# EAGLE design aria-BOB (EAGLE 7.2.0)
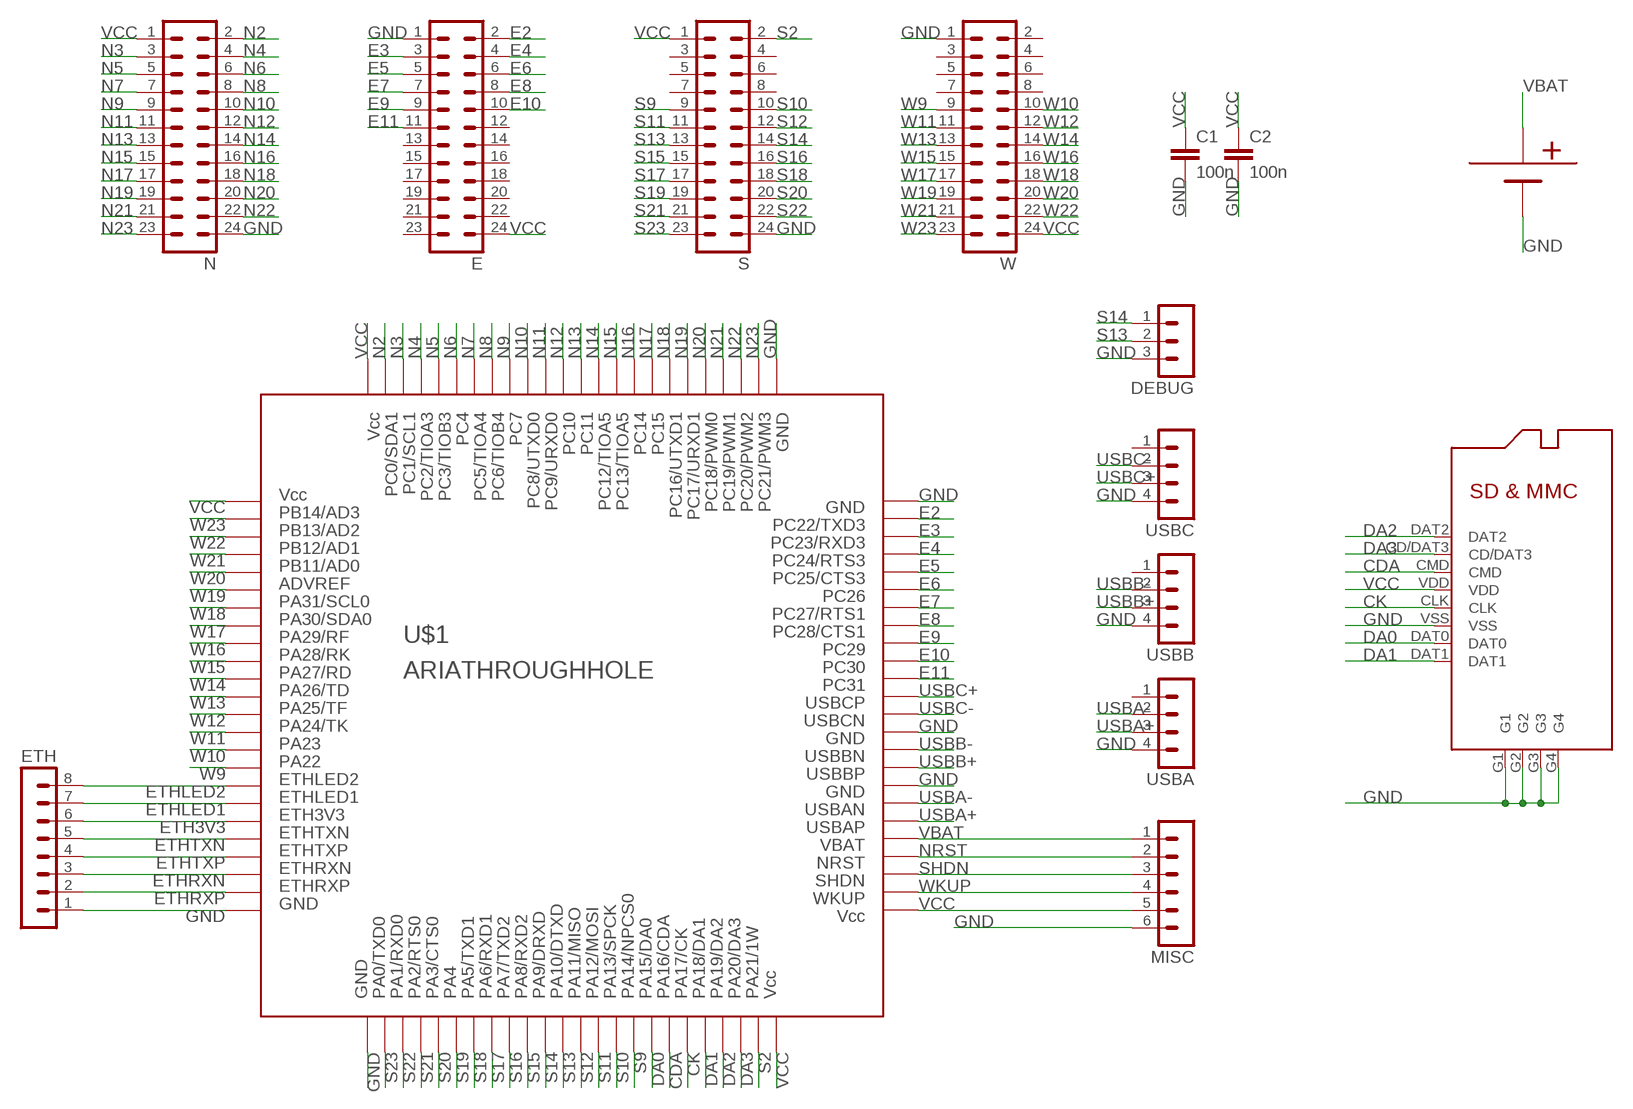
[diagram p0: schematic, sheet 1]

## Parts
C1  100n  C-EUC0603  [C0603]
C2  100n  C-EUC0603  [C0603]
DEBUG  MA03-1  [MA03-1]
E  MA12-2  [MA12-2]
ETH  MA08-1  [MA08-1]
MISC  MA06-1  [MA06-1]
N  MA12-2  [MA12-2]
S  MA12-2  [MA12-2]
U$1  ARIATHROUGHHOLE  [ARIA-TROUGHHOLE]
U$3  BAT  [BAT-CR1220]
U$4  MICRO-SD  [MISCRO-SD]
USBA  MA04-1  [MA04-1]
USBB  MA04-1  [MA04-1]
USBC  MA04-1  [MA04-1]
W  MA12-2  [MA12-2]

## Nets
CDA: U$1.S7 U$4.CMD
CK: U$1.S6 U$4.CLK
DA0: U$1.S8 U$4.DAT0
DA1: U$1.S5 U$4.DAT1
DA2: U$1.S4 U$4.DAT2
DA3: U$1.S3 U$4.CD/DAT3
E2: E.2 U$1.E2
E3: E.3 U$1.E3
E4: E.4 U$1.E4
E5: E.5 U$1.E5
E6: E.6 U$1.E6
E7: E.7 U$1.E7
E8: E.8 U$1.E8
E9: E.9 U$1.E9
E10: E.10 U$1.E10
E11: E.11 U$1.E11
ETH3V3: ETH.6 U$1.W6
ETHLED1: ETH.7 U$1.W7
ETHLED2: ETH.8 U$1.W8
ETHRXN: ETH.3 U$1.W3
ETHRXP: ETH.2 U$1.W2
ETHTXN: ETH.5 U$1.W5
ETHTXP: ETH.4 U$1.W4
GND: C1.2 C2.2 DEBUG.3 E.1 ETH.1 MISC.6 N.24 S.24 U$1.E1 U$1.E14 U$1.E17 U$1.N24 U$1.S24 U$1.W1 U$3.BAT- U$4.G1 U$4.G2 U$4.G3 U$4.G4 U$4.VSS USBA.4 USBB.4 USBC.4 W.1
N2: N.2 U$1.N2
N3: N.3 U$1.N3
N4: N.4 U$1.N4
N5: N.5 U$1.N5
N6: N.6 U$1.N6
N7: N.7 U$1.N7
N8: N.8 U$1.N8
N9: N.9 U$1.N9
N10: N.10 U$1.N10
N11: N.11 U$1.N11
N12: N.12 U$1.N12
N13: N.13 U$1.N13
N14: N.14 U$1.N14
N15: N.15 U$1.N15
N16: N.16 U$1.N16
N17: N.17 U$1.N17
N18: N.18 U$1.N18
N19: N.19 U$1.N19
N20: N.20 U$1.N20
N21: N.21 U$1.N21
N22: N.22 U$1.N22
N23: N.23 U$1.N23
NRST: MISC.2 U$1.E21
S2: S.2 U$1.S2
S9: S.9 U$1.S9
S10: S.10 U$1.S10
S11: S.11 U$1.S11
S12: S.12 U$1.S12
S13: DEBUG.2 S.13 U$1.S13
S14: DEBUG.1 S.14 U$1.S14
S15: S.15 U$1.S15
S16: S.16 U$1.S16
S17: S.17 U$1.S17
S18: S.18 U$1.S18
S19: S.19 U$1.S19
S20: S.20 U$1.S20
S21: S.21 U$1.S21
S22: S.22 U$1.S22
S23: S.23 U$1.S23
SHDN: MISC.3 U$1.E22
USBA+: U$1.E19 USBA.3
USBA-: U$1.E18 USBA.2
USBB+: U$1.E16 USBB.3
USBB-: U$1.E15 USBB.2
USBC+: U$1.E12 USBC.3
USBC-: U$1.E13 USBC.2
VBAT: MISC.1 U$1.E20 U$3.BAT1+(BAT+) U$3.BAT+
VCC: C1.1 C2.1 E.24 MISC.5 N.1 S.1 U$1.E24 U$1.N1 U$1.S1 U$1.W24 U$4.VDD W.24
W9: U$1.W9 W.9
W10: U$1.W10 W.10
W11: U$1.W11 W.11
W12: U$1.W12 W.12
W13: U$1.W13 W.13
W14: U$1.W14 W.14
W15: U$1.W15 W.15
W16: U$1.W16 W.16
W17: U$1.W17 W.17
W18: U$1.W18 W.18
W19: U$1.W19 W.19
W20: U$1.W20 W.20
W21: U$1.W21 W.21
W22: U$1.W22 W.22
W23: U$1.W23 W.23
WKUP: MISC.4 U$1.E23
Unconnected: E.12 E.13 E.14 E.15 E.16 E.17 E.18 E.19 E.20 E.21 E.22 E.23 S.3 S.4 S.5 S.6 S.7 S.8 USBA.1 USBB.1 USBC.1 W.2 W.3 W.4 W.5 W.6 W.7 W.8

## Library data of the parts
C1 C2 = rcl:C-EU: CAPACITOR, European symbol
DEBUG = con-lstb:MA03-1: PIN HEADER; OC_FARNELL: unknown; OC_NEWARK: unknown
E N S W = con-lstb:MA12-2: PIN HEADER; OC_FARNELL: unknown; OC_NEWARK: unknown
ETH = con-lstb:MA08-1: PIN HEADER; OC_FARNELL: unknown; OC_NEWARK: unknown
MISC = con-lstb:MA06-1: PIN HEADER; OC_FARNELL: unknown; OC_NEWARK: unknown
U$1 = octanis-beat:ARIA
U$3 = octanis-beat:BAT
U$4 = octanis-beat:MICRO-SD
USBA USBB USBC = con-lstb:MA04-1: PIN HEADER; OC_FARNELL: unknown; OC_NEWARK: unknown

## Board
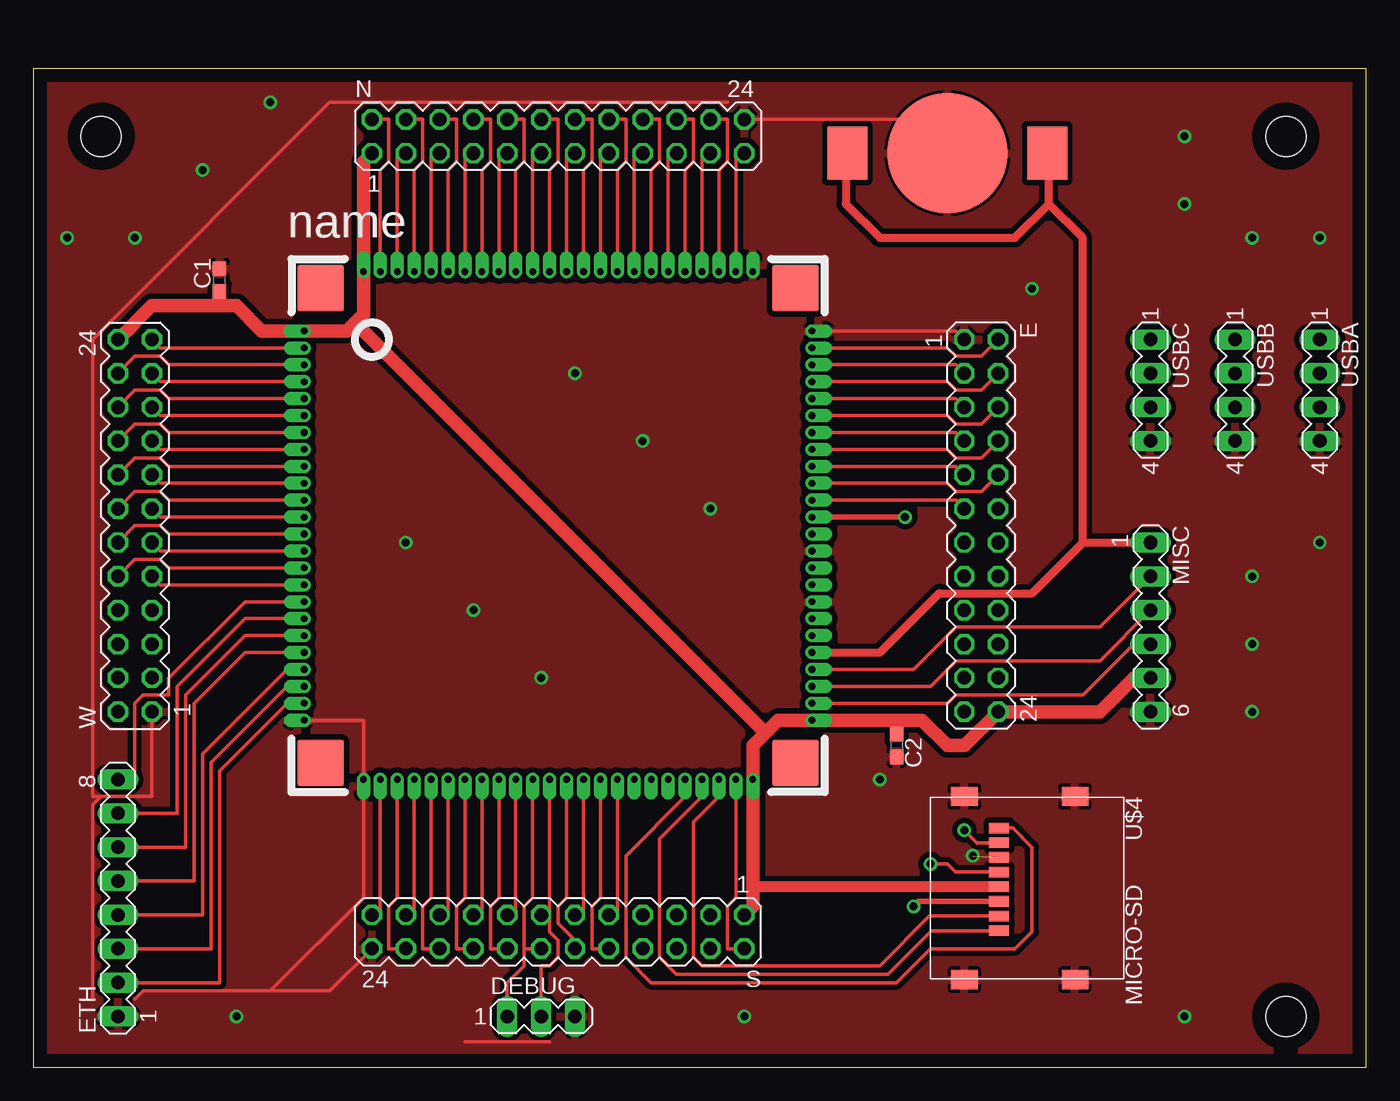
[diagram p1: board, top side]
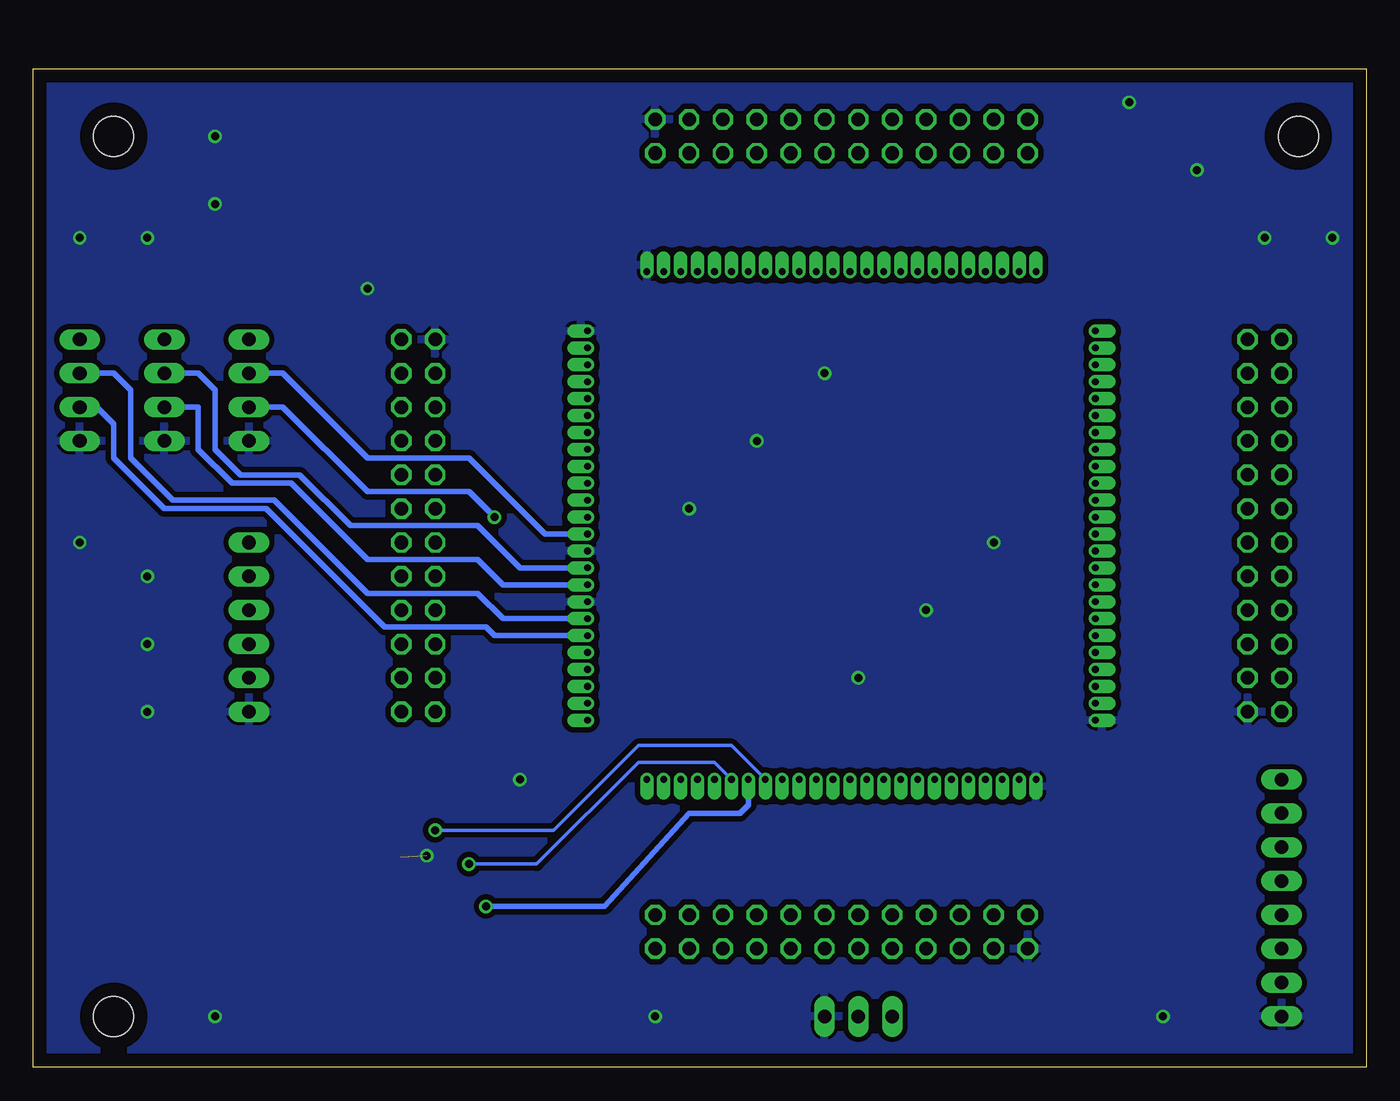
[diagram p2: board, bottom side, seen from below]

Size 100 x 74.92 mm. Coordinates in mm from the lower left corner, seen from the top.
Outline: 0,0 100,0 100,74.92 0,74.92 0,0
Copper layers (1*16): Top 0.035mm / dielectric 1.5mm / Bottom 0.035mm
Design rules "default": minimum track width 10mil, minimum drill 24mil, track to track 8mil, track to pad 8mil, pad to pad 8mil, via to via 8mil, smd to smd 8mil, copper to edge 40mil, drill to drill 8mil, minimum pad ring 10mil, minimum via ring 8mil, stop-mask expansion 4mil, vias tented up to drill 0mil, thermal gap 10mil
Holes 3 mm at 5.08,69.85 93.98,69.85 93.98,3.81

### Footprints (pad centres in the part's own frame; a part is rotated, then mirrored left to right if it is on the bottom)
C0603 = smd 1.1 x 1: 1 -0.85,0; 2 0.85,0
MA03-1 = drill 1.016 long: 1 -2.54,0; 2 0,0; 3 2.54,0
MA12-2 = drill 1.016 octagon: 1 -13.97,-1.27; 2 -13.97,1.27; 3 -11.43,-1.27; 4 -11.43,1.27; 5 -8.89,-1.27; 6 -8.89,1.27; 7 -6.35,-1.27; 8 -6.35,1.27; 9 -3.81,-1.27; 10 -3.81,1.27; 11 -1.27,-1.27; 12 -1.27,1.27; 13 1.27,-1.27; 14 1.27,1.27; 15 3.81,-1.27; 16 3.81,1.27; 17 6.35,-1.27; 18 6.35,1.27; 19 8.89,-1.27; 20 8.89,1.27; 21 11.43,-1.27; 22 11.43,1.27; 23 13.97,-1.27; 24 13.97,1.27
MA08-1 = drill 1.016 long: 1 -8.89,0; 2 -6.35,0; 3 -3.81,0; 4 -1.27,0; 5 1.27,0; 6 3.81,0; 7 6.35,0; 8 8.89,0
MA06-1 = drill 1.016 long: 1 -6.35,0; 2 -3.81,0; 3 -1.27,0; 4 1.27,0; 5 3.81,0; 6 6.35,0
ARIA-TROUGHHOLE = drill 0.5 pad 0.813 offset: E1 19.05,14.605; E2 19.05,13.335; E3 19.05,12.065; E4 19.05,10.795; E5 19.05,9.525; E6 19.05,8.255; E7 19.05,6.985; E8 19.05,5.715; E9 19.05,4.445; E10 19.05,3.175; E11 19.05,1.905; E12 19.05,0.635; E13 19.05,-0.635; E14 19.05,-1.905; E15 19.05,-3.175; E16 19.05,-4.445; E17 19.05,-5.715; E18 19.05,-6.985; E19 19.05,-8.255; E20 19.05,-9.525; E21 19.05,-10.795; E22 19.05,-12.065; E23 19.05,-13.335; E24 19.05,-14.605; N1 -14.605,19.05; N2 -13.335,19.05; N3 -12.065,19.05; N4 -10.795,19.05; N5 -9.525,19.05; N6 -8.255,19.05; N7 -6.985,19.05; N8 -5.715,19.05; N9 -4.445,19.05; N10 -3.175,19.05; N11 -1.905,19.05; N12 -0.635,19.05; N13 0.635,19.05; N14 1.905,19.05; N15 3.175,19.05; N16 4.445,19.05; N17 5.715,19.05; N18 6.985,19.05; N19 8.255,19.05; N20 9.525,19.05; N21 10.795,19.05; N22 12.065,19.05; N23 13.335,19.05; N24 14.605,19.05; S1 14.605,-19.05; S2 13.335,-19.05; S3 12.065,-19.05; S4 10.795,-19.05; S5 9.525,-19.05; S6 8.255,-19.05; S7 6.985,-19.05; S8 5.715,-19.05; S9 4.445,-19.05; S10 3.175,-19.05; S11 1.905,-19.05; S12 0.635,-19.05; S13 -0.635,-19.05; S14 -1.905,-19.05; S15 -3.175,-19.05; S16 -4.445,-19.05; S17 -5.715,-19.05; S18 -6.985,-19.05; S19 -8.255,-19.05; S20 -9.525,-19.05; S21 -10.795,-19.05; S22 -12.065,-19.05; S23 -13.335,-19.05; S24 -14.605,-19.05; W1 -19.05,-14.605; W2 -19.05,-13.335; W3 -19.05,-12.065; W4 -19.05,-10.795; W5 -19.05,-9.525; W6 -19.05,-8.255; W7 -19.05,-6.985; W8 -19.05,-5.715; W9 -19.05,-4.445; W10 -19.05,-3.175; W11 -19.05,-1.905; W12 -19.05,-0.635; W13 -19.05,0.635; W14 -19.05,1.905; W15 -19.05,3.175; W16 -19.05,4.445; W17 -19.05,5.715; W18 -19.05,6.985; W19 -19.05,8.255; W20 -19.05,9.525; W21 -19.05,10.795; W22 -19.05,12.065; W23 -19.05,13.335; W24 -19.05,14.605 | smd 3.5 x 3.5: H1 -17.8,17.8; H2 17.8,17.8; H3 17.8,-17.8; H4 -17.8,-17.8
BAT-CR1220 = smd 3 x 4: BAT1+ 7.5,0; BAT+ -7.5,0 | smd 9 x 9: BAT- 0,0
MISCRO-SD = smd 0.8 x 1.5: CD/DAT3 8.98,2.6; CLK 5.68,2.6; CMD 7.88,2.6; DAT0 3.48,2.6; DAT1 2.38,2.6; DAT2 10.08,2.6; VDD 6.78,2.6; VSS 4.58,2.6 | smd 1.45 x 2: G1 13.75,0; G2 13.75,8.3; G3 0,8.3; G4 0,0
MA04-1 = drill 1.016 long: 1 -3.81,0; 2 -1.27,0; 3 1.27,0; 4 3.81,0

### Placement (x,y rotation side)
C1  13.97,59.05 90 top
C2  64.77,24.13 270 top
DEBUG  38.1,3.81 0 top
E  71.12,40.64 270 top
ETH  6.35,12.7 90 top
MISC  83.82,33.02 270 top
N  39.37,69.85 0 top
S  39.37,10.16 180 top
U$1  39.37,40.64 0 top
U$3  68.58,68.58 0 top
U$4  69.85,20.32 270 top
USBA  96.52,50.8 270 top
USBB  90.17,50.8 270 top
USBC  83.82,50.8 270 top
W  7.62,40.64 90 top

### Tracks (layer width: path | path; a pad name or v marks a point on that pad's centre or on a via)
CDA  (via drill 0.6)
  Top 0.406: v66.04,12.07 66.42,12.44 U$4.CMD
  Bottom 0.406: v66.04,12.07 57.15,12.07 50.8,19.05 46.99,19.05 46.35,19.68 U$1.S7
CK  (via drill 0.6)
  Top 0.254: v67.31,15.24 68.58,15.24 69.18,14.64 U$4.CLK
  Bottom 0.254: U$1.S6 48.9,22.86 54.61,22.86 62.23,15.24 v67.31,15.24
DA0  (via drill 0.6)
  Top 0.254: 73.03,16.67 72.71,16.99 72.39,16.99 | 71.91,16.99 72.39,16.99 | v69.85,17.78 70.79,16.84 U$4.DAT0 72.45,16.93 72.39,16.99
  Bottom 0.254: U$1.S8 47.62,24.13 54.61,24.13 60.96,17.78 v69.85,17.78
DA1
  Top 0.254: U$1.S5 48.9,20.32 44.45,15.88 44.45,8.26 46.35,6.35 64.77,6.35 67.31,8.89 73.66,8.89 74.93,10.16 74.93,16.51 73.5,17.94 U$4.DAT1
DA2
  Top 0.254: U$1.S4 50.16,20.32 46.99,17.14 46.99,8.26 48.26,6.99 64.14,6.99 67.39,10.24 U$4.DAT2
DA3
  Top 0.254: U$1.S3 51.44,20.32 49.53,18.41 49.53,8.26 50.16,7.62 63.5,7.62 67.22,11.34 U$4.CD/DAT3
E2
  Top 0.254: U$1.E2 68.58,53.97 69.22,53.34 71.12,53.34 E.2
E3
  Top 0.254: U$1.E3 69.22,52.7 E.3
E4
  Top 0.254: U$1.E4 68.58,51.43 69.22,50.8 71.12,50.8 E.4
E5
  Top 0.254: U$1.E5 69.22,50.16 E.5
E6
  Top 0.254: U$1.E6 68.58,48.89 69.22,48.26 71.12,48.26 E.6
E7
  Top 0.254: U$1.E7 69.22,47.62 E.7
E8
  Top 0.254: U$1.E8 68.58,46.35 69.22,45.72 71.12,45.72 E.8
E9
  Top 0.254: U$1.E9 69.22,45.08 E.9
E10
  Top 0.254: U$1.E10 68.58,43.81 69.22,43.18 71.12,43.18 E.10
E11
  Top 0.254: U$1.E11 69.22,42.54 E.11
ETH3V3
  Top 0.254: U$1.W6 15.88,32.38 11.43,27.94 11.43,16.51 ETH.6
ETHLED1
  Top 0.254: U$1.W7 15.88,33.65 10.79,28.57 10.79,19.05 ETH.7
ETHLED2
  Top 0.254: U$1.W8 15.88,34.92 10.16,29.21 10.16,27.94 8.26,27.94 7.62,27.3 7.62,21.59 ETH.8
ETHRXN
  Top 0.254: U$1.W3 19.05,28.57 13.34,22.86 13.34,8.89 ETH.3
ETHRXP
  Top 0.254: U$1.W2 19.05,27.3 13.97,22.23 13.97,6.35 ETH.2
ETHTXN
  Top 0.254: U$1.W5 15.88,31.11 12.06,27.3 12.06,13.97 ETH.5
ETHTXP
  Top 0.254: U$1.W4 19.05,29.84 12.7,23.5 12.7,11.43 ETH.4
GND  (via drill 0.6)  (1 unrouted)
  Top 0.254: U$1.E1 69.22,55.24 E.1 | U$3.BAT- 66.04,71.12 N.24 | U$1.W1 24.77,26.04 U$1.S24 24.77,12.7 17.78,5.71 | 7.62,5.08 8.26,5.71 17.78,5.71 | 17.78,5.71 22.23,5.71 S.24 | W.1 8.89,20.32 5.08,20.32 | 5.08,20.32 4.45,19.68 4.45,5.08 | 38.73,1.9 32.38,1.9 | 52.07,72.39 22.23,72.39 4.45,54.61 4.45,20.32 5.08,20.32
  other vias: 74.93,58.42 86.36,69.85 96.52,62.23 91.44,62.23 86.36,64.77 96.52,39.37 91.44,36.83 91.44,26.67 86.36,3.81 91.44,31.75 63.5,21.59 45.72,46.99 40.64,52.07 27.94,39.37 33.02,34.29 38.1,29.21 50.8,41.91 2.54,62.23 12.7,67.31 7.62,62.23 17.78,72.39 15.24,3.81 53.34,3.81 70.48,15.88
  pour Bottom (isolate 0.406): 0,78.74 100.33,78.74 100.33,-1.27 0,-1.27
  pour Top (isolate 0.406): 0,74.93 100.33,74.93 100.33,-1.27 0,-1.27
N2
  Top 0.254: U$1.N2 26.04,67.31 26.67,67.95 26.67,71.12 N.2
N3
  Top 0.254: U$1.N3 27.3,68.58 N.3
N4
  Top 0.254: U$1.N4 28.57,67.31 29.21,67.95 29.21,71.12 N.4
N5
  Top 0.254: U$1.N5 29.84,68.58 N.5
N6
  Top 0.254: U$1.N6 31.11,67.31 31.75,67.95 31.75,71.12 N.6
N7
  Top 0.254: U$1.N7 32.38,68.58 N.7
N8
  Top 0.254: U$1.N8 33.66,67.31 34.29,67.95 34.29,71.12 N.8
N9
  Top 0.254: U$1.N9 34.92,68.58 N.9
N10
  Top 0.254: U$1.N10 36.2,67.31 36.83,67.95 36.83,71.12 N.10
N11
  Top 0.254: U$1.N11 37.47,68.58 N.11
N12
  Top 0.254: U$1.N12 38.73,67.31 39.37,67.95 39.37,71.12 N.12
N13
  Top 0.254: U$1.N13 40.01,68.58 N.13
N14
  Top 0.254: U$1.N14 41.27,67.31 41.91,67.95 41.91,71.12 N.14
N15
  Top 0.254: U$1.N15 42.55,68.58 N.15
N16
  Top 0.254: U$1.N16 43.81,67.31 44.45,67.95 44.45,71.12 N.16
N17
  Top 0.254: U$1.N17 45.09,68.58 N.17
N18
  Top 0.254: U$1.N18 46.35,67.31 46.99,67.95 46.99,71.12 N.18
N19
  Top 0.254: U$1.N19 47.62,68.58 N.19
N20
  Top 0.254: U$1.N20 48.9,67.31 49.53,67.95 49.53,71.12 N.20
N21
  Top 0.254: U$1.N21 50.16,68.58 N.21
N22
  Top 0.254: U$1.N22 51.44,67.31 52.07,67.95 52.07,71.12 N.22
N23
  Top 0.254: U$1.N23 52.7,68.58 N.23
NRST
  Top 0.254: U$1.E21 66.04,29.84 69.22,33.02 80.01,33.02 MISC.2
S2
  Top 0.254: U$1.S2 52.7,12.7 52.07,12.07 52.07,8.89 S.2
S9
  Top 0.254: U$1.S9 43.81,11.43 S.9
S10
  Top 0.254: U$1.S10 42.55,12.7 41.91,12.07 41.91,8.89 S.10
S11
  Top 0.254: U$1.S11 41.27,11.43 S.11
S12
  Top 0.254: U$1.S12 40.01,12.7 39.37,12.07 39.37,10.79 40.64,9.53 S.12
S13
  Top 0.254: 38.73,11.43 U$1.S13 | DEBUG.2 38.1,7.62 38.73,7.62 39.37,8.26 39.37,9.53 38.73,10.16 38.73,11.43 | 38.73,11.43 S.13
S14
  Top 0.254: U$1.S14 37.47,12.7 36.83,12.07 36.83,8.89 | S.14 36.83,8.89 | DEBUG.1 35.56,6.35 36.83,7.62 36.83,8.89
S15
  Top 0.254: U$1.S15 36.2,11.43 S.15
S16
  Top 0.254: U$1.S16 34.92,12.7 34.29,12.07 34.29,8.89 S.16
S17
  Top 0.254: U$1.S17 33.66,11.43 S.17
S18
  Top 0.254: U$1.S18 32.38,12.7 31.75,12.07 31.75,8.89 S.18
S19
  Top 0.254: U$1.S19 31.11,11.43 S.19
S20
  Top 0.254: U$1.S20 29.84,12.7 29.21,12.07 29.21,8.89 S.20
S21
  Top 0.254: U$1.S21 28.57,11.43 S.21
S22
  Top 0.254: U$1.S22 27.3,12.7 26.67,12.07 26.67,8.89 S.22
S23
  Top 0.254: U$1.S23 26.04,11.43 S.23
SHDN
  Top 0.254: U$1.E22 67.31,28.57 69.22,30.48 80.01,30.48 MISC.3
USBA+
  Bottom 0.406: U$1.E19 65.41,32.38 66.04,33.02 73.66,33.02 82.55,41.91 90.17,41.91 93.98,45.72 93.98,48.26 95.25,49.53 USBA.3
USBA-
  Bottom 0.406: USBA.2 93.98,52.07 92.71,50.8 92.71,45.72 89.53,42.54 81.92,42.54 74.93,35.56 66.67,35.56 64.77,33.65 U$1.E18
USBB+
  Bottom 0.406: USBB.3 87.63,49.53 87.63,46.35 85.09,43.81 80.64,43.81 74.93,38.1 66.67,38.1 64.77,36.2 U$1.E16
USBB-
  Bottom 0.406: USBB.2 87.63,52.07 86.36,50.8 86.36,46.35 84.45,44.45 80.01,44.45 76.2,40.64 66.67,40.64 63.5,37.46 U$1.E15
USBC+  (via drill 0.6)
  Top 0.406: U$1.E12 v65.41,41.27
  Bottom 0.406: USBC.3 81.28,49.53 74.93,43.18 67.31,43.18 v65.41,41.27
USBC-
  Bottom 0.406: USBC.2 81.28,52.07 74.93,45.72 67.31,45.72 61.59,40 U$1.E13
VBAT
  Top 0.61: U$1.E20 63.5,31.11 67.94,35.56 74.93,35.56 78.74,39.37 | 78.74,39.37 MISC.1 | U$3.BAT+ 60.96,68.46 60.96,64.77 63.5,62.23 73.66,62.23 76.2,64.77 | 76.2,64.77 76.2,68.46 U$3.BAT1+ | 78.74,39.37 78.74,62.23 76.2,64.77
VCC
  Top 0.61: 53.98,13.54 53.98,13.97
  Top 0.813: 53.99,13.35 53.98,13.34 | U$4.VDD 53.98,13.54 | C2.1 64.77,26.04 | C1.1 13.97,57.15
  Top 1.016: W.24 8.89,57.15 13.97,57.15 15.24,57.15 17.14,55.24 U$1.W24 23.5,55.24 24.13,55.88 | N.1 24.77,67.95 U$1.N1 24.77,56.51 24.13,55.88 | MISC.5 82.55,29.21 80.01,26.67 E.24 69.85,24.13 68.58,24.13 66.67,26.04 64.77,26.04 U$1.E24 55.88,26.04 54.93,25.08 | 54.93,25.08 53.98,24.13 U$1.S1 53.98,13.97 53.98,13.34 53.98,12.07 S.1 | 24.13,55.88 54.93,25.08
W9
  Top 0.254: U$1.W9 9.53,36.2 W.9
W10
  Top 0.254: U$1.W10 10.16,37.46 9.53,38.1 7.62,38.1 W.10
W11
  Top 0.254: U$1.W11 9.53,38.73 W.11
W12
  Top 0.254: U$1.W12 10.16,40 9.53,40.64 7.62,40.64 W.12
W13
  Top 0.254: U$1.W13 9.53,41.27 W.13
W14
  Top 0.254: U$1.W14 10.16,42.54 9.53,43.18 7.62,43.18 W.14
W15
  Top 0.254: U$1.W15 9.53,43.81 W.15
W16
  Top 0.254: U$1.W16 10.16,45.08 9.53,45.72 7.62,45.72 W.16
W17
  Top 0.254: U$1.W17 9.53,46.35 W.17
W18
  Top 0.254: U$1.W18 10.16,47.62 9.53,48.26 7.62,48.26 W.18
W19
  Top 0.254: U$1.W19 9.53,48.89 W.19
W20
  Top 0.254: U$1.W20 10.16,50.16 9.53,50.8 7.62,50.8 W.20
W21
  Top 0.254: U$1.W21 9.53,51.43 W.21
W22
  Top 0.254: U$1.W22 10.16,52.7 9.53,53.34 7.62,53.34 W.22
W23
  Top 0.254: U$1.W23 9.53,53.97 W.23
WKUP
  Top 0.254: U$1.E23 68.58,27.3 69.22,27.94 78.74,27.94 82.55,31.75 MISC.4

### Text on the board
tValues: Aria Breakout v1 | octanis.org